# EAGLE design shieldrasp3 (EAGLE 9.5.0)
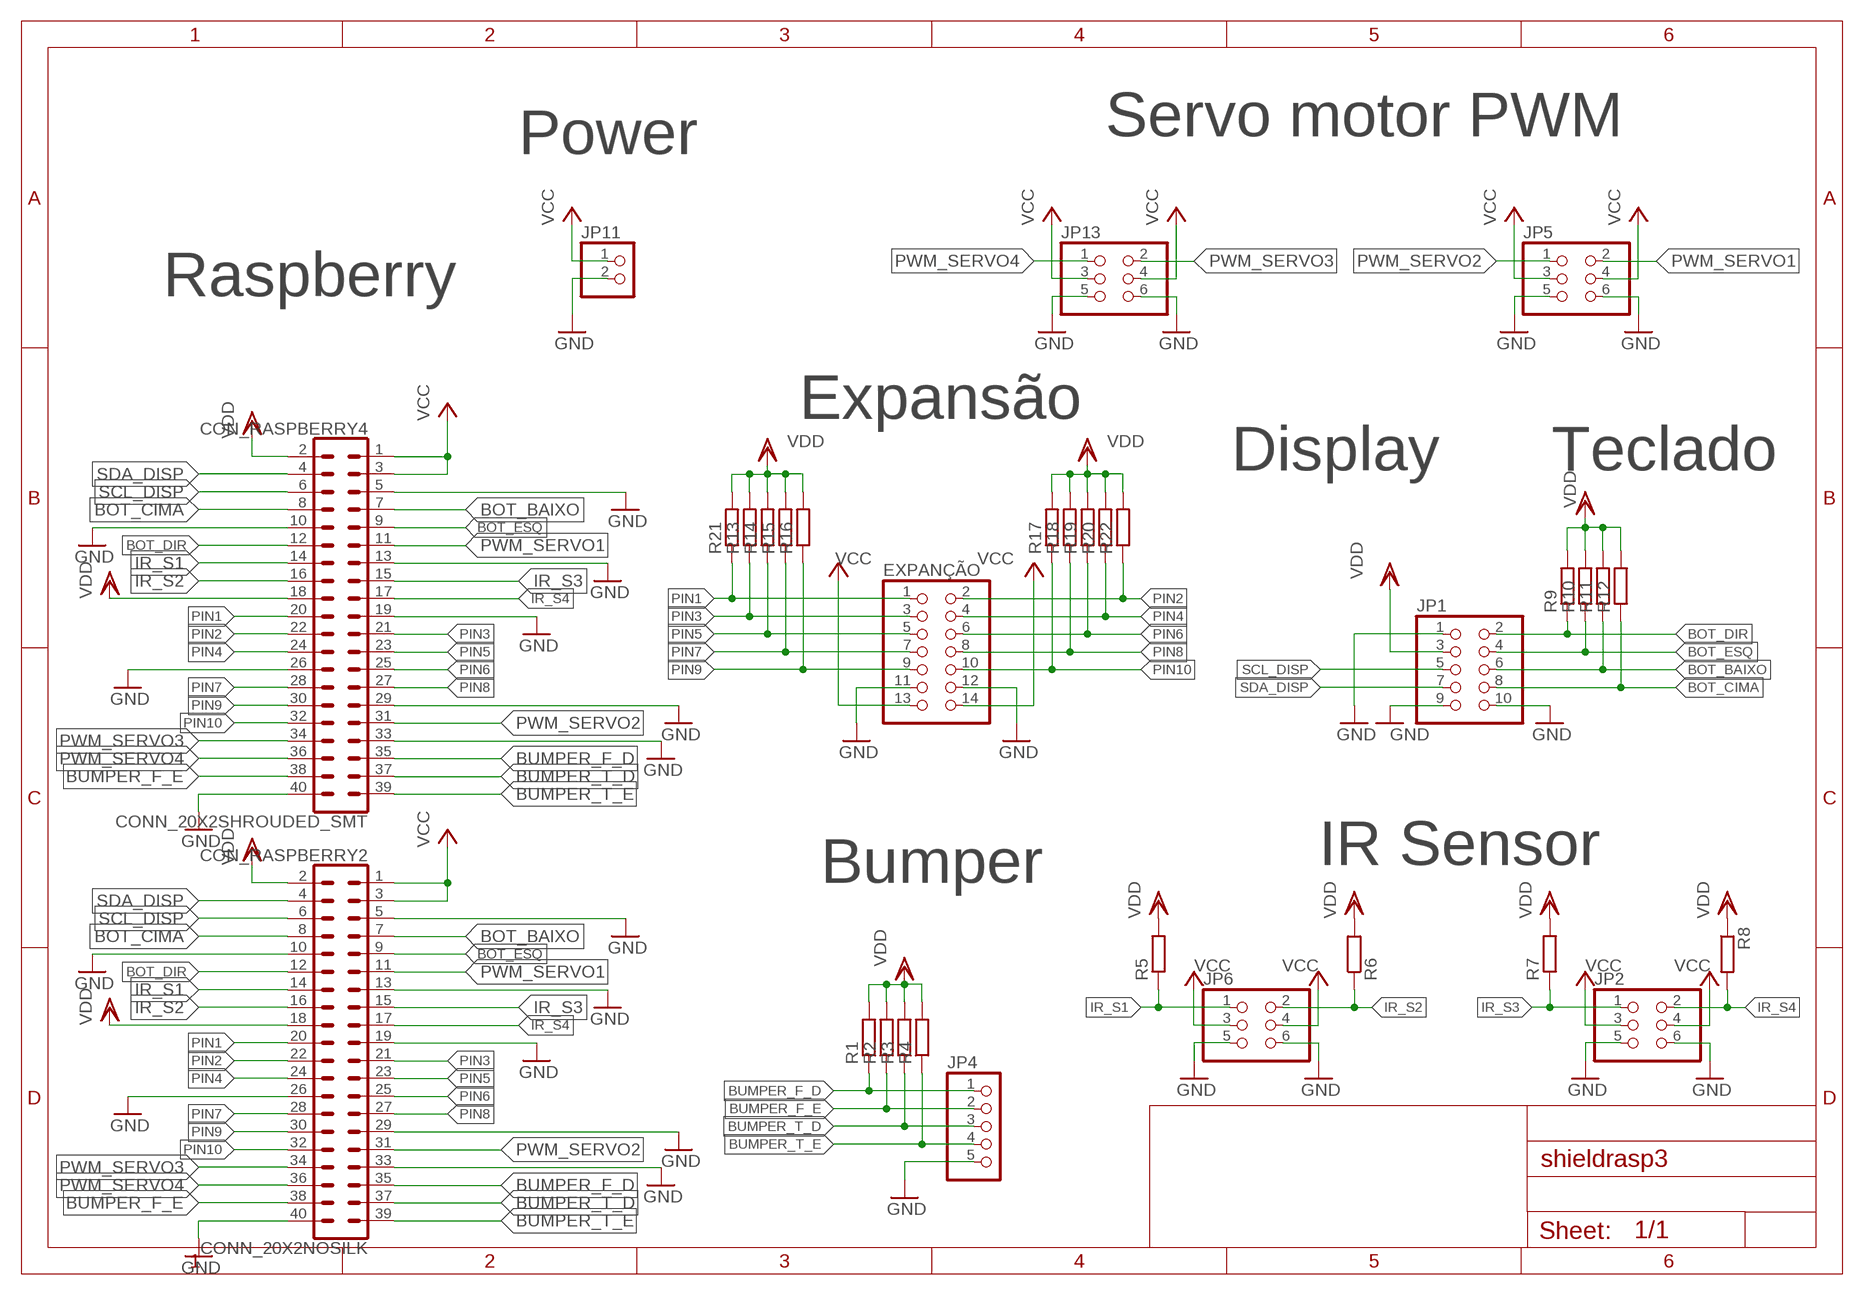
[diagram p0: schematic, sheet 1]

## Parts
CON_RASPBERRY2  CONN_20X2NOSILK  [2X20_NOSILK]
CON_RASPBERRY4  CONN_20X2SHROUDED_SMT  [2X20_SHROUDED_SMT]
EXPANÇÃO  PINHD-2X7  [2X07]
JP1  PINHD-2X5  [2X05]
JP2  PINHD-2X3  [2X03]
JP4  PINHD-1X5  [1X05]
JP5  PINHD-2X3  [2X03]
JP6  PINHD-2X3  [2X03]
JP11  PINHD-1X2  [1X02]
JP13  PINHD-2X3  [2X03]
R1  R-EU_M0805  [M0805]
R2  R-EU_M0805  [M0805]
R3  R-EU_M0805  [M0805]
R4  R-EU_M0805  [M0805]
R5  R-EU_M0805  [M0805]
R6  R-EU_M0805  [M0805]
R7  R-EU_M0805  [M0805]
R8  R-EU_M0805  [M0805]
R9  R-EU_M0805  [M0805]
R10  R-EU_M0805  [M0805]
R11  R-EU_M0805  [M0805]
R12  R-EU_M0805  [M0805]
R13  R-EU_M0805  [M0805]
R14  R-EU_M0805  [M0805]
R15  R-EU_M0805  [M0805]
R16  R-EU_M0805  [M0805]
R17  R-EU_M0805  [M0805]
R18  R-EU_M0805  [M0805]
R19  R-EU_M0805  [M0805]
R20  R-EU_M0805  [M0805]
R21  R-EU_M0805  [M0805]
R22  R-EU_M0805  [M0805]

## Nets
BOT_BAIXO: CON_RASPBERRY2.7 CON_RASPBERRY4.7 JP1.6 R11.1
BOT_CIMA: CON_RASPBERRY2.8 CON_RASPBERRY4.8 JP1.8 R12.1
BOT_DIR: CON_RASPBERRY2.12 CON_RASPBERRY4.12 JP1.2 R9.1
BOT_ESQ: CON_RASPBERRY2.9 CON_RASPBERRY4.9 JP1.4 R10.1
BUMPER_F_D: CON_RASPBERRY2.35 CON_RASPBERRY4.35 JP4.1 R1.1
BUMPER_F_E: CON_RASPBERRY2.38 CON_RASPBERRY4.38 JP4.2 R2.1
BUMPER_T_D: CON_RASPBERRY2.37 CON_RASPBERRY4.37 JP4.3 R3.1
BUMPER_T_E: CON_RASPBERRY2.39 CON_RASPBERRY4.39 JP4.4 R4.1
GND: CON_RASPBERRY2.5 CON_RASPBERRY2.10 CON_RASPBERRY2.13 CON_RASPBERRY2.19 CON_RASPBERRY2.26 CON_RASPBERRY2.29 CON_RASPBERRY2.33 CON_RASPBERRY2.40 CON_RASPBERRY4.5 CON_RASPBERRY4.10 CON_RASPBERRY4.13 CON_RASPBERRY4.19 CON_RASPBERRY4.26 CON_RASPBERRY4.29 CON_RASPBERRY4.33 CON_RASPBERRY4.40 EXPANÇÃO.11 EXPANÇÃO.12 JP1.1 JP1.9 JP1.10 JP2.5 JP2.6 JP4.5 JP5.5 JP5.6 JP6.5 JP6.6 JP11.2 JP13.5 JP13.6
IR_S1: CON_RASPBERRY2.14 CON_RASPBERRY4.14 JP6.1 R5.1
IR_S2: CON_RASPBERRY2.16 CON_RASPBERRY4.16 JP6.2 R6.1
IR_S3: CON_RASPBERRY2.15 CON_RASPBERRY4.15 JP2.1 R7.1
IR_S4: CON_RASPBERRY2.17 CON_RASPBERRY4.17 JP2.2 R8.2
PIN1: CON_RASPBERRY2.20 CON_RASPBERRY4.20 EXPANÇÃO.1 R21.1
PIN2: CON_RASPBERRY2.22 CON_RASPBERRY4.22 EXPANÇÃO.2 R22.1
PIN3: CON_RASPBERRY2.21 CON_RASPBERRY4.21 EXPANÇÃO.3 R13.1
PIN4: CON_RASPBERRY2.24 CON_RASPBERRY4.24 EXPANÇÃO.4 R20.1
PIN5: CON_RASPBERRY2.23 CON_RASPBERRY4.23 EXPANÇÃO.5 R14.1
PIN6: CON_RASPBERRY2.25 CON_RASPBERRY4.25 EXPANÇÃO.6 R19.1
PIN7: CON_RASPBERRY2.28 CON_RASPBERRY4.28 EXPANÇÃO.7 R15.1
PIN8: CON_RASPBERRY2.27 CON_RASPBERRY4.27 EXPANÇÃO.8 R18.1
PIN9: CON_RASPBERRY2.30 CON_RASPBERRY4.30 EXPANÇÃO.9 R16.1
PIN10: CON_RASPBERRY2.32 CON_RASPBERRY4.32 EXPANÇÃO.10 R17.1
PWM_SERVO1: CON_RASPBERRY2.11 CON_RASPBERRY4.11 JP5.2
PWM_SERVO2: CON_RASPBERRY2.31 CON_RASPBERRY4.31 JP5.1
PWM_SERVO3: CON_RASPBERRY2.34 CON_RASPBERRY4.34 JP13.2
PWM_SERVO4: CON_RASPBERRY2.36 CON_RASPBERRY4.36 JP13.1
SCL_DISP: CON_RASPBERRY2.6 CON_RASPBERRY4.6 JP1.5
SDA_DISP: CON_RASPBERRY2.4 CON_RASPBERRY4.4 JP1.7
VCC [vcc]: CON_RASPBERRY2.1 CON_RASPBERRY2.3 CON_RASPBERRY4.1 CON_RASPBERRY4.3 EXPANÇÃO.13 EXPANÇÃO.14 JP2.3 JP2.4 JP5.3 JP5.4 JP6.3 JP6.4 JP11.1 JP13.3 JP13.4
VDD [vcc]: CON_RASPBERRY2.2 CON_RASPBERRY2.18 CON_RASPBERRY4.2 CON_RASPBERRY4.18 JP1.3 R1.2 R2.2 R3.2 R4.2 R5.2 R6.2 R7.2 R8.1 R9.2 R10.2 R11.2 R12.2 R13.2 R14.2 R15.2 R16.2 R17.2 R18.2 R19.2 R20.2 R21.2 R22.2

## Notes on the sheet
- Power | Servo motor PWM
- Raspberry
- Expansão
- Display | Teclado
- Bumper | IR Sensor

## Library data of the parts
CON_RASPBERRY2 = SparkFun-Connectors:CONN_20X2: Multi connection point. Often used as Generic Header-pin footprint for 0.1 inch spaced/style header connections On any of the 0.1 inch spaced packages, you can populate with these: Break Away Headers - Straight <https://www.sparkfun.com/products/116> (PRT-00116) Break Away Male Headers - Right Angle <https://www.sparkfun.com/products/553> (PRT-00553) Female Headers <https://www.sparkfun.com/products/115> (PRT-00115) Break Away Headers - Machine Pin <https://www.sparkfun.com/products/117> (PRT-00117) Break Away Female Headers - Swiss Machine Pin <https://www.sparkfun.com/products/743> (PRT-00743)
CON_RASPBERRY4 = SparkFun-Connectors:CONN_20X2: Multi connection point. Often used as Generic Header-pin footprint for 0.1 inch spaced/style header connections On any of the 0.1 inch spaced packages, you can populate with these: Break Away Headers - Straight <https://www.sparkfun.com/products/116> (PRT-00116) Break Away Male Headers - Right Angle <https://www.sparkfun.com/products/553> (PRT-00553) Female Headers <https://www.sparkfun.com/products/115> (PRT-00115) Break Away Headers - Machine Pin <https://www.sparkfun.com/products/117> (PRT-00117) Break Away Female Headers - Swiss Machine Pin <https://www.sparkfun.com/products/743> (PRT-00743); PROD_ID: CONN-13143
EXPANÇÃO = pinhead:PINHD-2X7: PIN HEADER
JP1 = pinhead:PINHD-2X5: PIN HEADER
JP2 JP5 JP6 JP13 = pinhead:PINHD-2X3: PIN HEADER
JP4 = pinhead:PINHD-1X5: PIN HEADER
JP11 = pinhead:PINHD-1X2: PIN HEADER
R1-R22 = rcl:R-EU_: RESISTOR, European symbol; SPICEPREFIX: R

## Net classes
1 vcc: width 0.508 mm

## Board
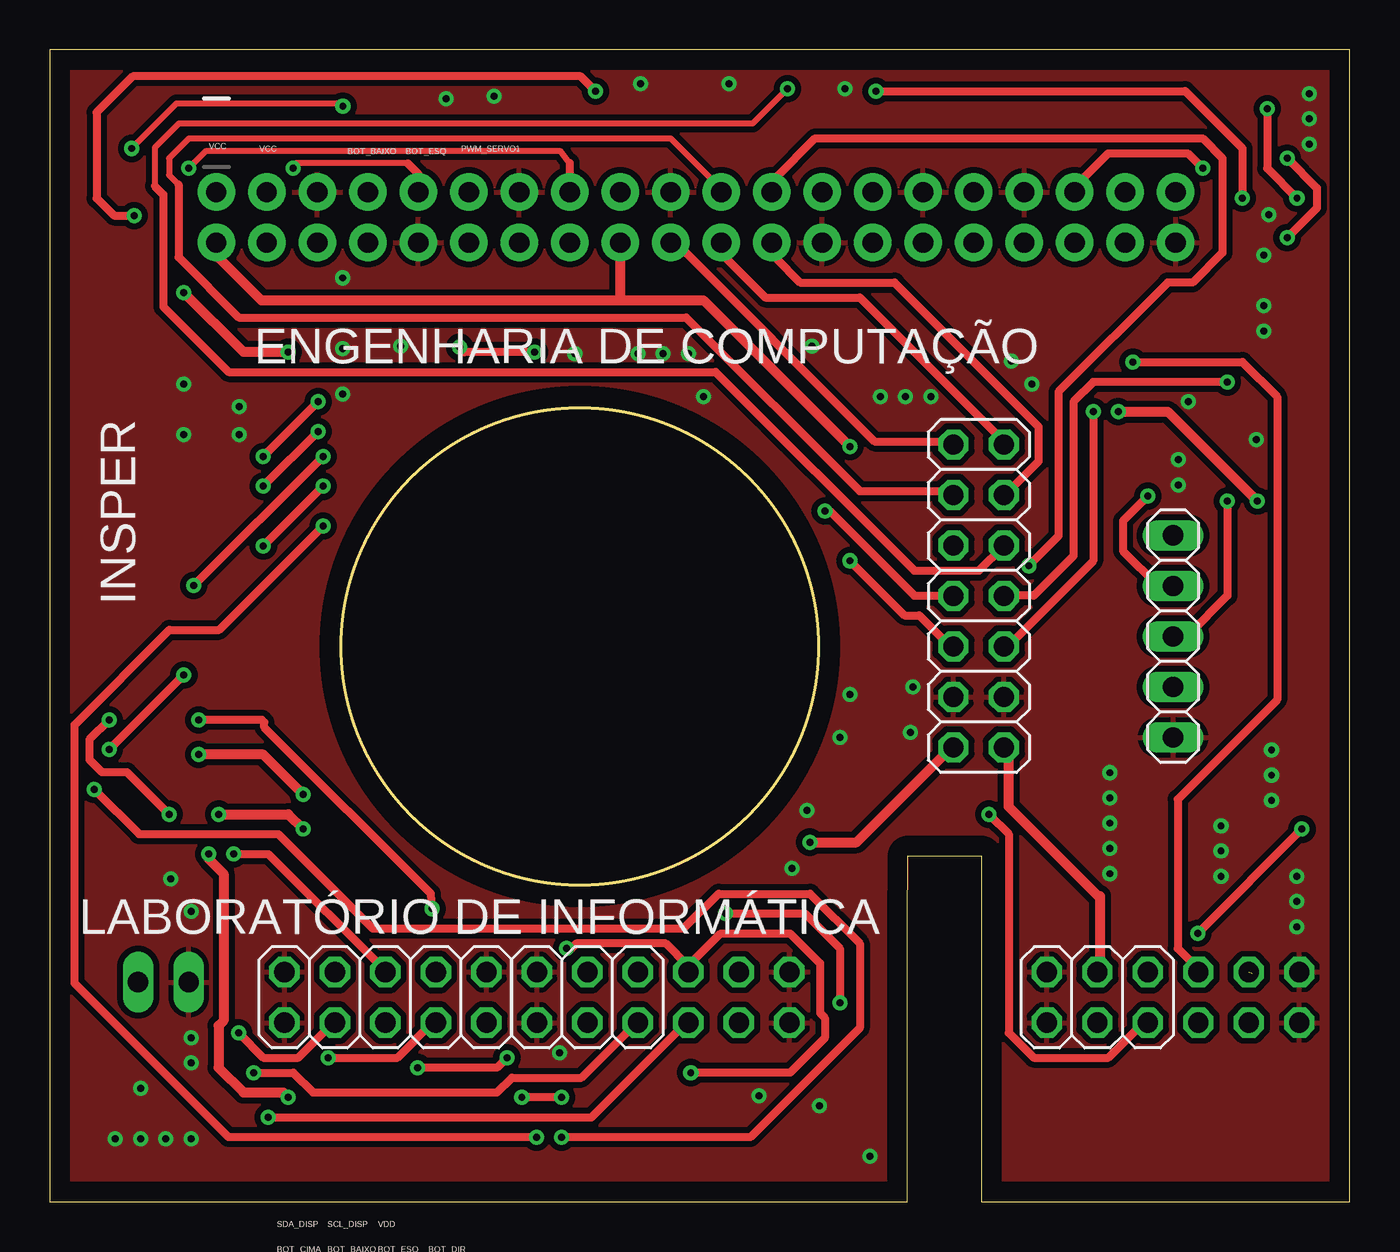
[diagram p1: board, top side]
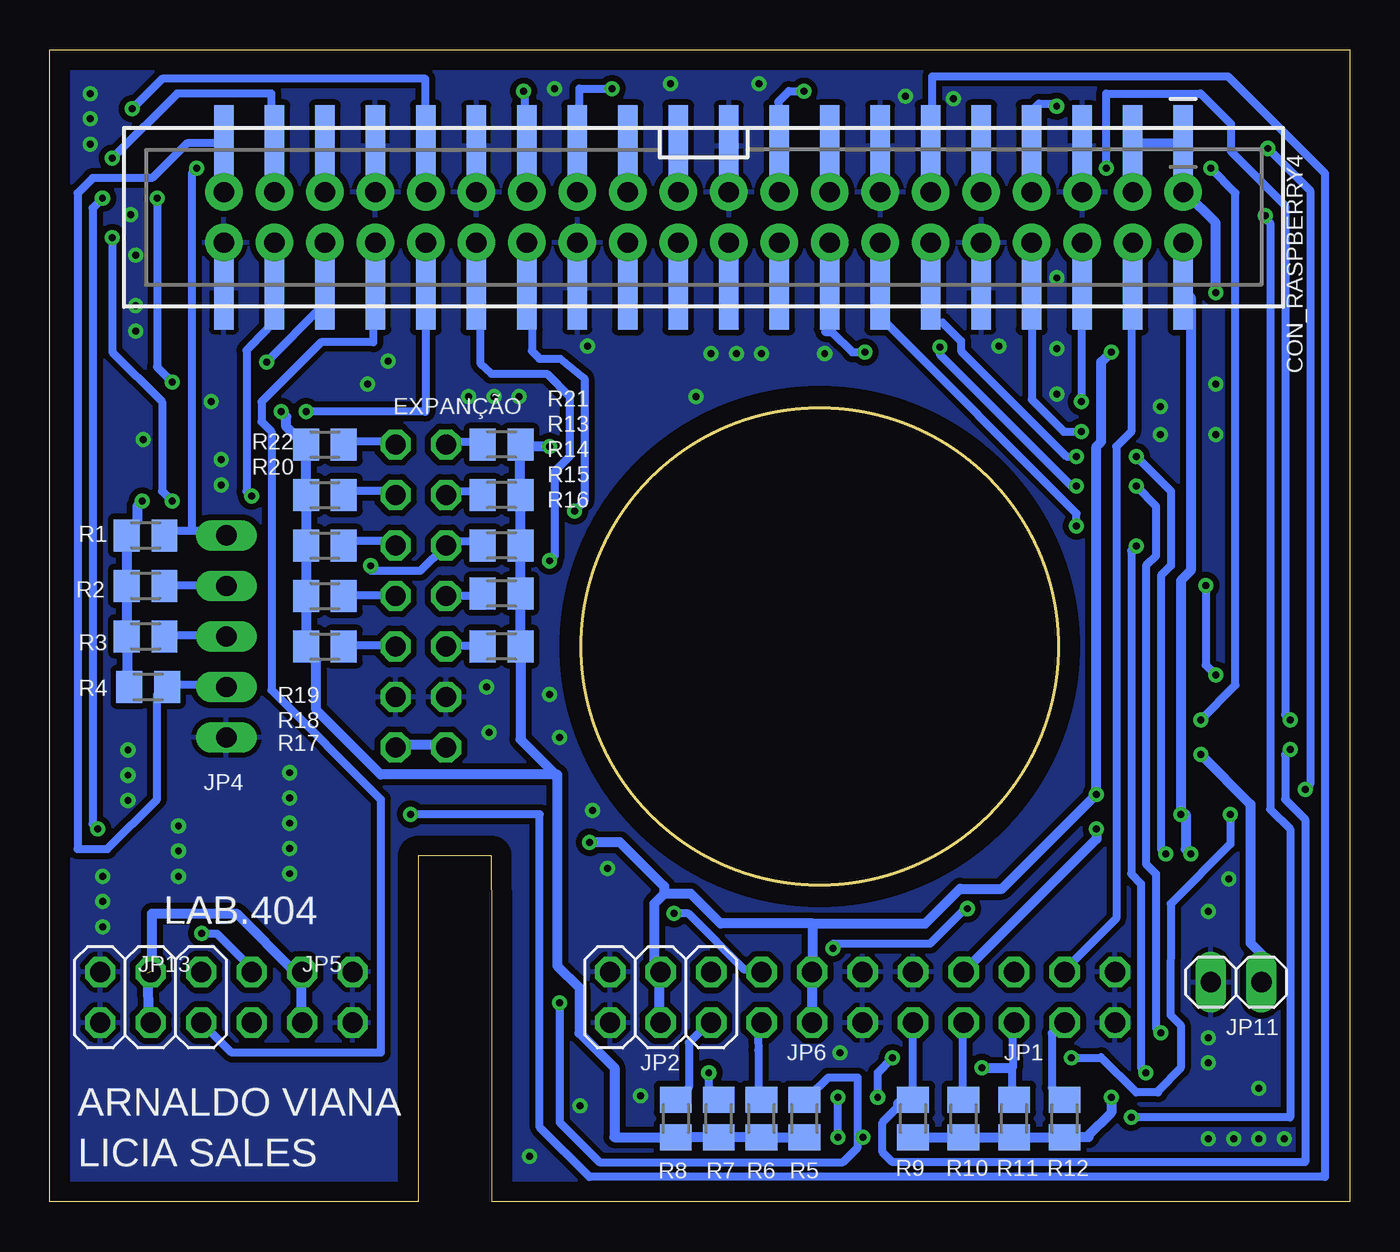
[diagram p2: board, bottom side, seen from below]

Size 65.41 x 57.96 mm. Coordinates in mm from the lower left corner, seen from the top.
Outline: 0,0 43.16,0 43.16,13.95 43.18,17.4 46.86,17.4 46.86,0 65.41,0 65.41,57.96 0,57.96 0,0
Outline: circle at 26.67,27.94 radius 12
Copper layers (1*16): Top 0.035mm / dielectric 1.5mm / Bottom 0.035mm
Design rules "default *": minimum track width 12mil, minimum drill 0.35mm, track to track 12mil, track to pad 12mil, pad to pad 12mil, via to via 12mil, smd to smd 12mil, copper to edge 40mil, drill to drill 6mil, minimum pad ring 10mil, minimum via ring 8mil, stop-mask expansion 4mil, vias tented up to drill 0mil, thermal gap 10mil

### Footprints (pad centres in the part's own frame; a part is rotated, then mirrored left to right if it is on the bottom)
2X20_NOSILK = drill 1.016 pad 1.88: 1 0,0; 2 0,2.54; 3 2.54,0; 4 2.54,2.54; 5 5.08,0; 6 5.08,2.54; 7 7.62,0; 8 7.62,2.54; 9 10.16,0; 10 10.16,2.54; 11 12.7,0; 12 12.7,2.54; 13 15.24,0; 14 15.24,2.54; 15 17.78,0; 16 17.78,2.54; 17 20.32,0; 18 20.32,2.54; 19 22.86,0; 20 22.86,2.54; 21 25.4,0; 22 25.4,2.54; 23 27.94,0; 24 27.94,2.54; 25 30.48,0; 26 30.48,2.54; 27 33.02,0; 28 33.02,2.54; 29 35.56,0; 30 35.56,2.54; 31 38.1,0; 32 38.1,2.54; 33 40.64,0; 34 40.64,2.54; 35 43.18,0; 36 43.18,2.54; 37 45.72,0; 38 45.72,2.54; 39 48.26,0; 40 48.26,2.54
2X20_SHROUDED_SMT = smd 4.14 x 0.991: 1 -3.569,24.13; 2 3.569,24.13; 3 -3.569,21.59; 4 3.569,21.59; 5 -3.569,19.05; 6 3.569,19.05; 7 -3.569,16.51; 8 3.569,16.51; 9 -3.569,13.97; 10 3.569,13.97; 11 -3.569,11.43; 12 3.569,11.43; 13 -3.569,8.89; 14 3.569,8.89; 15 -3.569,6.35; 16 3.569,6.35; 17 -3.569,3.81; 18 3.569,3.81; 19 -3.569,1.27; 20 3.569,1.27; 21 -3.569,-1.27; 22 3.569,-1.27; 23 -3.569,-3.81; 24 3.569,-3.81; 25 -3.569,-6.35; 26 3.569,-6.35; 27 -3.569,-8.89; 28 3.569,-8.89; 29 -3.569,-11.43; 30 3.569,-11.43; 31 -3.569,-13.97; 32 3.569,-13.97; 33 -3.569,-16.51; 34 3.569,-16.51; 35 -3.569,-19.05; 36 3.569,-19.05; 37 -3.569,-21.59; 38 3.569,-21.59; 39 -3.569,-24.13; 40 3.569,-24.13
2X07 = drill 1.016 octagon: 1 -7.62,-1.27; 2 -7.62,1.27; 3 -5.08,-1.27; 4 -5.08,1.27; 5 -2.54,-1.27; 6 -2.54,1.27; 7 0,-1.27; 8 0,1.27; 9 2.54,-1.27; 10 2.54,1.27; 11 5.08,-1.27; 12 5.08,1.27; 13 7.62,-1.27; 14 7.62,1.27
2X05 = drill 1.016 octagon: 1 -5.08,-1.27; 2 -5.08,1.27; 3 -2.54,-1.27; 4 -2.54,1.27; 5 0,-1.27; 6 0,1.27; 7 2.54,-1.27; 8 2.54,1.27; 9 5.08,-1.27; 10 5.08,1.27
2X03 = drill 1.016 octagon: 1 -2.54,-1.27; 2 -2.54,1.27; 3 0,-1.27; 4 0,1.27; 5 2.54,-1.27; 6 2.54,1.27
1X05 = drill 1.016 long: 1 -5.08,0; 2 -2.54,0; 3 0,0; 4 2.54,0; 5 5.08,0
1X02 = drill 1.016 long: 1 -1.27,0; 2 1.27,0
M0805 = smd 1.3 x 1.6: 1 -0.95,0; 2 0.95,0

### Placement (x,y rotation side)
CON_RASPBERRY2  8.38,50.8 180 bottom
CON_RASPBERRY4  32.51,49.53 270 bottom
EXPANÇÃO  46.74,30.48 270 top
JP1  16.89,10.29 180 top
JP2  34.67,10.29 180 bottom
JP4  56.52,28.45 270 top
JP5  52.7,10.29 180 top
JP6  27.05,10.29 180 top
JP11  5.71,11.05 180 bottom
JP13  60.33,10.29 180 bottom
R1  60.58,33.53 180 bottom
R2  60.58,30.99 180 bottom
R3  60.58,28.45 180 bottom
R4  60.45,25.91 180 bottom
R5  27.43,4.19 270 bottom
R6  29.59,4.19 270 bottom
R7  31.75,4.19 270 bottom
R8  33.91,4.19 90 bottom
R9  21.97,4.19 270 bottom
R10  19.43,4.19 270 bottom
R11  16.89,4.19 270 bottom
R12  14.35,4.19 270 bottom
R13  42.67,35.56 0 bottom
R14  42.67,33.02 0 bottom
R15  42.67,30.61 0 bottom
R16  42.67,27.94 0 bottom
R17  51.56,27.94 180 bottom
R18  51.56,30.48 180 bottom
R19  51.56,33.02 180 bottom
R20  51.56,35.56 180 bottom
R21  42.67,38.1 0 bottom
R22  51.56,38.1 180 bottom

### Tracks (layer width: path | path; a pad name or v marks a point on that pad's centre or on a via)
BOT_BAIXO  (via drill 0.35)
  Top 0.305: v4.12,53 6.37,55.25 14.62,55.25
  Top 0.406: v18.5,6.75 22.5,6.75 v23,7.25 | v25.75,5.25 v23.75,5.25 | v25.75,3.25 35.25,3.25 40.75,8.75 40.75,13 38.25,15.5 33.65,15.5 31.9,13.75 16.25,13.75 11.5,18.5 4.5,18.5 v2.25,20.75 | v14.75,55.12 14.62,55.25
  Bottom 0.406: 17,6.75 17,5.25 R11.1 | JP1.6 17,8.9 16.96,6.75 18.48,6.75 v18.5,6.75 | CON_RASPBERRY2.7 16,51 16,53 CON_RASPBERRY4.7 16,53.25 16,54.88 15.64,55.25 14.75,55.25 v14.75,55.12 | v23,7.25 23.75,6.5 v23.75,5.25 | v25.75,3.25 v25.75,5.25 | v2.25,20.75 2,21 2,50.87 v4.12,53
  Bottom 0.508: 18.48,6.75 17,6.75
BOT_CIMA  (via drill 0.35)
  Top 0.406: v9.5,8.5 10.75,7.25 12.5,7.25 14.35,9.1 JP1.8 | v13.5,38.75 v10.75,36
  Bottom 0.406: R12.1 14.5,5.25 15,5.75 15,8.5 14.36,9.14 JP1.8 | CON_RASPBERRY2.8 16,46 CON_RASPBERRY4.8 16,45.75 16,40.36 14.39,38.75 v13.5,38.75 | v9.5,8.5 9.75,8.75 9.75,16.5 10.25,17 10.25,32 9.75,32.5 9.75,35 v10.75,36
BOT_DIR  (via drill 0.35)
  Top 0.406: v6.75,26.5 v3,22.75 | v13.75,37.5 v7.25,31
  Bottom 0.406: JP1.2 21.98,9.02 22,9 22,5.25 R9.1 22,5 22.75,5 22.75,4.75 23.5,4 23.5,2.5 23,2 2.25,2 2.25,19.25 3.25,20.25 3.25,22.5 v3,22.75 | CON_RASPBERRY2.12 21.25,48.25 21.25,46 CON_RASPBERRY4.12 21,45.75 21,44.24 20.49,44.24 19.56,43.31 19.56,42.8 19.18,42.42 14.26,37.5 v13.75,37.5 | v6.75,26.5 7.25,27 v7.25,31
BOT_ESQ  (via drill 0.35)
  Top 0.305: v12.25,52 12.25,52.13 12.37,52.25 18.01,52.25
  Top 0.406: v14,7.25 17.5,7.25 19.43,9.18 JP1.4 | v6,19.5 3.88,21.62 2.63,21.62 2,22.25 2,23.25 v3,24.25 | 18.01,52.25 18.54,51.72 CON_RASPBERRY2.9
  Bottom 0.406: R10.1 19.5,5.25 19.5,9 19.48,9.02 JP1.4 | CON_RASPBERRY2.9 18.5,51 18.5,53 CON_RASPBERRY4.9 | v14,7.25 12.52,7.25 12.52,7.27 10.75,5.5 9.64,5.5 9.64,5.6 8.51,6.73 8.51,8.89 9.02,9.4 9.01,14.99 6,18 v6,19.5 | v3,24.25 3.25,24.5 3.25,50.12 5.98,52.84 5.98,54.23 7.5,55.75 12.25,55.75 v12.25,52
BUMPER_F_D  (via drill 0.35)
  Top 0.406: v58,52 57.25,52.75 53.25,52.75 51.5,51 CON_RASPBERRY2.35
  Bottom 0.406: 58.25,33.75 55.48,33.75 56.35,33.7 JP4.1 | 58.25,33.75 59.5,33.75 R1.1 | 58.25,33.75 58.25,51.75 v58,52 | CON_RASPBERRY4.35 51.75,53 51.75,51 CON_RASPBERRY2.35
BUMPER_F_E  (via drill 0.35)
  Top 0.406: v55.25,35.5 54,34.25 54,32.75 55.75,31 56.5,31 JP4.2
  Bottom 0.406: R2.1 59.5,31 56.75,31 56.74,30.99 JP4.2 | v55.25,35.5 55.5,35.75 55.5,42.85 54.5,43.84 54.1,44.42 CON_RASPBERRY4.38 54.25,46 54.25,48.25 CON_RASPBERRY2.38
BUMPER_T_D  (via drill 0.35)
  Top 0.406: v59.25,35.25 59.25,30.5 57.25,28.5 56.75,28.5 56.7,28.45 JP4.3 | v62.25,48.5 63.75,50 63.75,51 v62.25,52.5
  Bottom 0.406: R3.1 59.5,28.5 56.75,28.5 56.7,28.45 JP4.3 | v59.25,35.25 59.75,35.75 59.75,40.25 62.25,42.75 v62.25,48.5 | v62.25,52.5 59,55.75 54.25,55.75 54.25,53.25 CON_RASPBERRY4.37 54.25,53 54.25,51 CON_RASPBERRY2.37
BUMPER_T_E
  Bottom 0.406: JP4.4 56.75,25.91 56.75,26 59.5,26 R4.1 59.75,25.75 60,25.5 60,20.25 62.5,17.75 64,17.75 64,50.75 63.25,51.5 60.25,51.5 58.5,53.25 56.75,53.25 CON_RASPBERRY4.39 56.75,53 56.75,51 CON_RASPBERRY2.39
GND  (via drill 0.35)
  other vias: 53.34,21.59 53.34,20.32 53.34,19.05 53.34,17.78 53.34,16.51 32.89,40.51 32.13,42.67 30.86,42.67 29.59,42.67 9.53,40.01 9.53,38.61 6.73,41.15 6.73,38.61 63.37,55.75 63.37,54.48 63.37,53.21 61.09,43.81 61.09,45.09 61.09,47.62 41.78,40.51 43.05,40.51 44.32,40.51 48.39,42.29 49.4,41.15 56.77,37.34 56.77,36.07 60.71,38.35 61.47,22.73 61.47,21.46 61.47,20.19 58.93,18.92 58.93,17.65 58.93,16.38 62.74,16.38 62.74,15.11 62.74,13.84 38.73,4.83 35.69,5.33 25.65,7.49 7.11,3.17 5.84,3.17 4.57,3.17 3.3,3.17 7.11,8.26 7.11,6.99 4.57,5.71 17.65,43.05 40.01,56.01 26.42,42.67 38.35,43.05 61.34,49.66 57.28,40.26 14.73,46.48 41.27,2.29 37.34,16.76 7.11,14.61 6.1,16.26 38.1,19.68 39.75,23.37 40.26,25.53 43.43,25.91 43.31,23.62 14.73,42.93 14.73,40.64 19.94,55.5 29.72,56.26 34.16,56.26 22.35,55.63
  pour Top: 0,0 0,58.42 66.04,58.42 66.04,0
  pour Bottom: 0,0 0,58.42 66.04,58.42 66.04,0
IR_S1  (via drill 0.35)
  Top 0.406: v39.75,10 39.75,12.75 38,14.5 v34,14.5 | v13.75,34 8.52,28.77 6.02,28.77 1.25,24 1.25,11 9,3.25 v24.5,3.25
  Bottom 0.406: CON_RASPBERRY2.14 23.75,48.25 23.75,46 CON_RASPBERRY4.14 23.62,44.51 13.75,34.63 v13.75,34 | 24.75,3.25 24.75,2.75 25.5,2 37.75,2 39.75,4 v39.75,10 | 24.75,3.25 24.75,6.25 26.25,6.25 27.25,5.25 R5.1 | v34,14.5 33.27,14.5 33.27,14.51 30.44,11.68 JP6.1 | 24.75,3.25 v24.5,3.25
IR_S2  (via drill 0.35)
  Top 0.406: v10.25,6.5 12.25,6.5 13.25,5.5 22.5,5.5 23.25,6.25 26.75,6.25 29.59,9.09 JP6.2 | v13.75,36 v10.75,33 | v24.39,42.75 20.87,42.75 v20.61,43
  Bottom 0.406: R6.1 29.75,5.25 29.75,7.62 29.79,8.82 JP6.2 | CON_RASPBERRY2.16 26.25,48.25 26.25,46 CON_RASPBERRY4.16 26.38,45.74 26.38,43.76 26.04,43.76 25.03,42.75 v24.39,42.75 | v10.25,6.5 10.5,6.75 10.5,16 11,16.5 11,32.75 v10.75,33 | v20.61,43 20.61,42.62 14,36 v13.75,36
IR_S3  (via drill 0.35)
  Top 0.305: v7,52 7.87,52.87 25.66,52.87 26.16,52.26
  Top 0.406: v32.25,6.5 37.25,6.5 39,8.25 39,9.25 38.75,9.5 38.75,12 37.25,13.5 33.75,13.5 32.12,11.87 JP2.1 32.12,11.88 31,13 26.5,13 26.25,12.75 v26,12.75 | v7.5,24.25 10.68,24.25 10.79,24.13 10.79,23.88 19.18,15.49 v19.24,14.75 | 26.16,52.26 CON_RASPBERRY2.15
  Bottom 0.406: CON_RASPBERRY2.15 26.25,51 26.25,53 CON_RASPBERRY4.15 | v32.25,6.5 32.25,5.75 31.75,5.25 R7.1 | v7,52 5.75,50.75 5.75,26 v7.5,24.25 | v19.24,14.75 19.35,14.75 21.1,13 26,13 v26,12.75
IR_S4  (via drill 0.35)
  Top 0.406: v11,4.25 27.25,4.25 32.13,9.13 JP2.2 | v4.25,49.62 3.23,49.62 2.36,50.49 2.36,54.81 4.18,56.63 26.71,56.63 v27.46,55.88
  Bottom 0.406: R8.2 33.75,5.25 33.25,5.75 33.25,8 32.13,9.12 JP2.2 | CON_RASPBERRY2.17 28.75,51 28.75,53 CON_RASPBERRY4.17 28.75,53.15 28.75,55.35 28.22,55.88 v27.46,55.88 | v11,4.25 3,4.25 3,18.75 4,19.75 4,49.24 4.25,49.49 v4.25,49.62
PIN1
  Top 0.406: EXPANÇÃO.1 45.25,38.25 41.5,38.25 31.25,48.5 CON_RASPBERRY2.20
  Bottom 0.406: R21.1 43.75,38.25 45.25,38.25 EXPANÇÃO.1 | CON_RASPBERRY4.20 31.25,46 CON_RASPBERRY2.20
PIN2
  Top 0.406: EXPANÇÃO.2 48,38.25 40.75,45.5 36,45.5 34,47.5 34,48.25 CON_RASPBERRY2.22
  Bottom 0.406: R22.1 50.5,38.25 48.25,38.25 EXPANÇÃO.2 | CON_RASPBERRY4.22 34,46 34,48.25 CON_RASPBERRY2.22
PIN3
  Top 0.305: 33.75,51 31.25,53.5 7,53.5 6,52.5 6,51.66 6.48,51.18
  Top 0.406: 6.48,51.18 6.48,47.52 9.51,44.49 32.01,44.49 40.75,35.75 45.25,35.75 EXPANÇÃO.3 | 33.75,51 CON_RASPBERRY2.21
  Bottom 0.406: R13.1 43.75,35.75 45.25,35.75 EXPANÇÃO.3 | CON_RASPBERRY4.21 34,53 34,51 CON_RASPBERRY2.21
PIN4
  Top 0.406: EXPANÇÃO.4 48.25,35.75 49.75,37.25 49.75,39 42.5,46.25 37.75,46.25 36.5,47.5 36.5,48.25 CON_RASPBERRY2.24
  Bottom 0.406: R20.1 50.5,35.75 48.25,35.75 EXPANÇÃO.4 | CON_RASPBERRY4.24 36.5,46 36.5,48.25 CON_RASPBERRY2.24
PIN5  (via drill 0.35)
  Top 0.406: v49.25,32 50.75,33.5 50.75,40.75 56.25,46.25 57.5,46.25 59,47.75 59,52.5 58,53.5 38.5,53.5 36.5,51.5 36.5,51 CON_RASPBERRY2.23
  Bottom 0.406: R14.1 43.75,33.25 45.25,33.25 EXPANÇÃO.5 45.5,33 46.75,31.75 49.25,31.75 v49.25,32 | CON_RASPBERRY4.23 36.5,53 36.5,51 CON_RASPBERRY2.23
PIN6  (via drill 0.35)
  Top 0.305: 5.29,52.8 5.29,52.79 | v37.12,56 35.37,54.25 6.5,54.25 5.29,53.04 5.29,52.8 | 5.29,52.8 5.29,51.1
  Top 0.406: EXPANÇÃO.6 48,33 46.75,31.75 43.5,31.75 33.5,41.75 9,41.75 5.71,45.03 5.71,50.67 5.29,51.1
  Bottom 0.406: R19.1 50.5,33.25 48.25,33.25 EXPANÇÃO.6 | v37.12,56 38.75,56 38.75,53.25 CON_RASPBERRY4.25 39,53 39,51 CON_RASPBERRY2.25
PIN7  (via drill 0.35)
  Top 0.406: v39,34.75 39.25,34.75 43.5,30.5 45.25,30.5 EXPANÇÃO.7
  Bottom 0.406: R15.1 43.75,30.5 45.25,30.5 EXPANÇÃO.7 | v39,34.75 38.5,35.25 38.5,41.42 39.73,42.42 40.77,42.42 41.15,42.8 41.15,44.07 41.25,44.17 41.25,45.75 CON_RASPBERRY4.28 41.5,46 41.5,48.25 CON_RASPBERRY2.28
PIN8  (via drill 0.35)
  Top 0.406: v59.25,41.25 52.5,41.25 51.5,40.25 51.5,32.5 49.5,30.5 48.25,30.5 EXPANÇÃO.8 | v60,50.5 60,53 57.12,55.88 v41.56,55.88
  Bottom 0.406: R18.1 50.5,30.5 48.25,30.5 EXPANÇÃO.8 | v59.25,41.25 60,42 v60,50.5 | v41.56,55.88 41.5,55.88 41.5,53.25 CON_RASPBERRY4.27 41.5,53 41.5,51 CON_RASPBERRY2.27
PIN9  (via drill 0.35)
  Top 0.406: v40.25,32.25 43,29.5 43.75,29.5 45.25,28 EXPANÇÃO.9
  Bottom 0.406: R16.1 43.75,28 45.25,28 EXPANÇÃO.9 | v40.25,32.25 40,32.5 40,36.75 39.25,37.5 39.25,40.52 40.39,41.66 43.18,41.66 43.75,42.21 43.75,45.75 CON_RASPBERRY4.30 44,46 44,48.25 CON_RASPBERRY2.30
PIN10  (via drill 0.35)
  Top 0.406: v52.5,39.75 52.5,32.25 48.25,28 EXPANÇÃO.10
  Bottom 0.406: R17.1 50.5,28 48.25,28 EXPANÇÃO.10 | v52.5,39.75 46.5,39.75 46.5,45.75 CON_RASPBERRY4.32 46.5,46 46.5,48.25 CON_RASPBERRY2.32
PWM_SERVO1  (via drill 0.35)
  Top 0.406: v47.25,19.5 48.25,18.5 48.25,8.5 49.5,7.25 53.25,7.25 55.23,9.23 JP5.2
  Bottom 0.406: v47.25,19.5 40.75,19.5 40.75,3.75 38.25,1.25 1.25,1.25 1.25,51.75 6.13,56.63 21,56.63 21,53.25 CON_RASPBERRY4.11 21.25,53 21.25,51 CON_RASPBERRY2.11
PWM_SERVO2  (via drill 0.35)
  Top 0.406: v63,18.75 v57.75,13.5 | v62.75,50.5 61.25,52 v61.25,55
  Bottom 0.406: v57.75,13.5 57,13.5 55.24,11.74 JP5.1 | v63,18.75 63.25,19 63.25,50 v62.75,50.5 | v61.25,55 59.75,56.5 46.5,56.5 46.5,53.25 CON_RASPBERRY4.31 46.5,53 46.5,51 CON_RASPBERRY2.31
PWM_SERVO3
  Bottom 0.406: JP13.2 57.78,9.04 56.25,7.5 48.75,7.5 48.75,20.25 54.25,25.75 54.25,38.75 54.75,39.25 54.75,40.25 51.75,43.25 49.12,43.25 49.12,45.87 CON_RASPBERRY4.34 49,46 49,48.25 CON_RASPBERRY2.34
PWM_SERVO4  (via drill 0.35)
  Top 0.406: v54.5,42.25 60,42.25 61.75,40.5 61.75,25.25 56.75,20.25 56.75,12.75 57.78,11.72 JP13.1
  Bottom 0.406: v54.5,42.25 51.75,45 51.75,45.75 CON_RASPBERRY4.36 51.75,46 51.75,48.25 CON_RASPBERRY2.36
SCL_DISP  (via drill 0.35)
  Top 0.406: v9.25,17.5 11,17.5 16.89,11.61 JP1.5 | v13.5,40.25 v10.75,37.5
  Bottom 0.406: v9.25,17.5 9.5,17.75 9.5,31.5 9,32 9,35.75 v10.75,37.5 | v13.5,40.25 13.5,45.75 CON_RASPBERRY4.6 13.5,46 13.5,48.25 CON_RASPBERRY2.6
SDA_DISP
  Bottom 0.406: JP1.7 14.35,11.65 11.75,14.25 11.75,38 11,38.75 11,45.75 CON_RASPBERRY4.4 11,46 11,48.25 CON_RASPBERRY2.4
VCC  (via drill 0.35)  (1 unrouted)
  Top 0.508: EXPANÇÃO.14 48.25,22.75 48.25,19.88 52.76,15.37 52.83,15.37 52.83,11.68 JP5.3 | v7.5,22.5 10.75,22.5 v12.75,20.5 | v6.75,45.75 9.75,42.75 v12,42.75 | v38.24,18.09 40.59,18.09 45.25,22.75 EXPANÇÃO.13
  Bottom 0.508: EXPANÇÃO.13 45.5,23 48,23 EXPANÇÃO.14 | JP5.4 52.71,9.21 52.75,9.25 52.75,11.5 52.7,11.54 JP5.3 53.08,11.58 56,14.5 60.25,14.5 60.25,11.63 JP13.3 | JP13.4 60.42,9.11 60.5,11.5 | CON_RASPBERRY2.3 11,51 11,53 CON_RASPBERRY4.3 10.75,53.27 8.55,53.27 CON_RASPBERRY4.1 8.5,53 8.5,51 CON_RASPBERRY2.1 8.25,50.75 6.75,49.25 v6.75,45.75 | JP2.4 34.67,9.17 34.75,9.25 34.75,11.5 34.73,11.5 JP2.3 34.67,11.67 35,12 35,15 34.5,15.5 | v7.5,22.5 5,20 5,13.02 4.46,12.48 JP11.1 | 27,14 21.35,14 19.6,15.75 17.5,15.75 v12.75,20.5 12.75,38 12.5,38.25 12.5,42.25 v12,42.75 | 27,14 27,11.75 27.05,11.7 JP6.3 | 27.16,9.13 JP6.4 JP6.3 | 27.21,11.71 JP6.3 | 34.5,15.5 33.15,15.5 31.65,14 27,14 | v38.24,18.09 36.71,18.09 34.5,15.88 34.5,15.5
VDD  (via drill 0.35)
  Top 0.508: v60.75,35.25 56.25,39.75 v53.75,39.75 | v12.75,18.75 12,19.5 v8.5,19.5 | v12,5.25 11.75,5.5 9.75,5.5 8.5,6.75 8.5,8.87 8.75,9.12 8.75,16.5 8,17.25 v8,17.5 | CON_RASPBERRY2.18 28.7,45.4 28.66,45.36 | 28.66,45.36 10.64,45.36 8.5,47.5 8.5,48.25 CON_RASPBERRY2.2 | v40.25,38 32.89,45.36 28.66,45.36
  Bottom 0.508: R4.2 61.5,26 61.5,28.25 R3.2 61.5,28.5 61.5,30.75 R2.2 61.5,31 61.5,33.5 R1.2 61.5,33.75 61,34.25 61,35 v60.75,35.25 | v53.75,39.75 53.5,39.5 53.5,39 52.75,38.25 R22.2 52.5,38 52.5,35.75 R20.2 52.5,35.5 52.5,33.25 R19.2 52.5,33 52.5,30.5 R18.2 52.5,30.25 52.5,28 R17.2 52.5,27.75 52,27.25 52,24.75 48.75,21.5 40,21.5 | R5.2 27.5,3.25 29.5,3.25 R6.2 29.75,3.25 R7.2 32,3.25 33.75,3.25 R8.1 34,3.25 37,3.25 37,6.75 38.75,8.5 38.75,10.75 39.87,11.88 39.87,21.5 40,21.5 | 40,21.5 40,21.55 41.72,23.27 R16.2 41.75,28 41.75,30.5 R15.2 41.75,30.75 41.75,33 R14.2 41.75,33.25 41.75,35.5 R13.2 41.75,35.75 41.75,38 R21.2 41.5,38 v40.25,38 | CON_RASPBERRY2.18 28.75,48.25 28.75,46 CON_RASPBERRY4.18 | R9.2 21.75,3.25 19.5,3.25 R10.2 19.25,3.25 17,3.25 R11.2 16.75,3.25 14.5,3.25 R12.2 14.25,3.25 13.14,3.25 13.14,3.35 12,4.49 v12,5.25 | v12.75,18.75 12.75,18.25 JP1.3 | CON_RASPBERRY2.2 8.5,48.25 8.5,46 CON_RASPBERRY4.2 8.25,45.75 8,45.5 8,31.75 8.5,31.25 v8.5,19.5 8.25,19.5 8.25,17.75 v8,17.5

### Text on the board
tNames: VCC | VCC | BOT_BAIXO | BOT_ESQ | PWM_SERVO1 | ENGENHARIA DE COMPUTAÇÃO | INSPER | LABORATÓRIO DE INFORMÁTICA | SDA_DISP | SCL_DISP | VDD | BOT_CIMA | BOT_BAIXO | BOT_ESQ | BOT_DIR
bNames: LAB.404 | ARNALDO VIANA | LICIA SALES
bValues: REV.1 | RASP4SHIELD